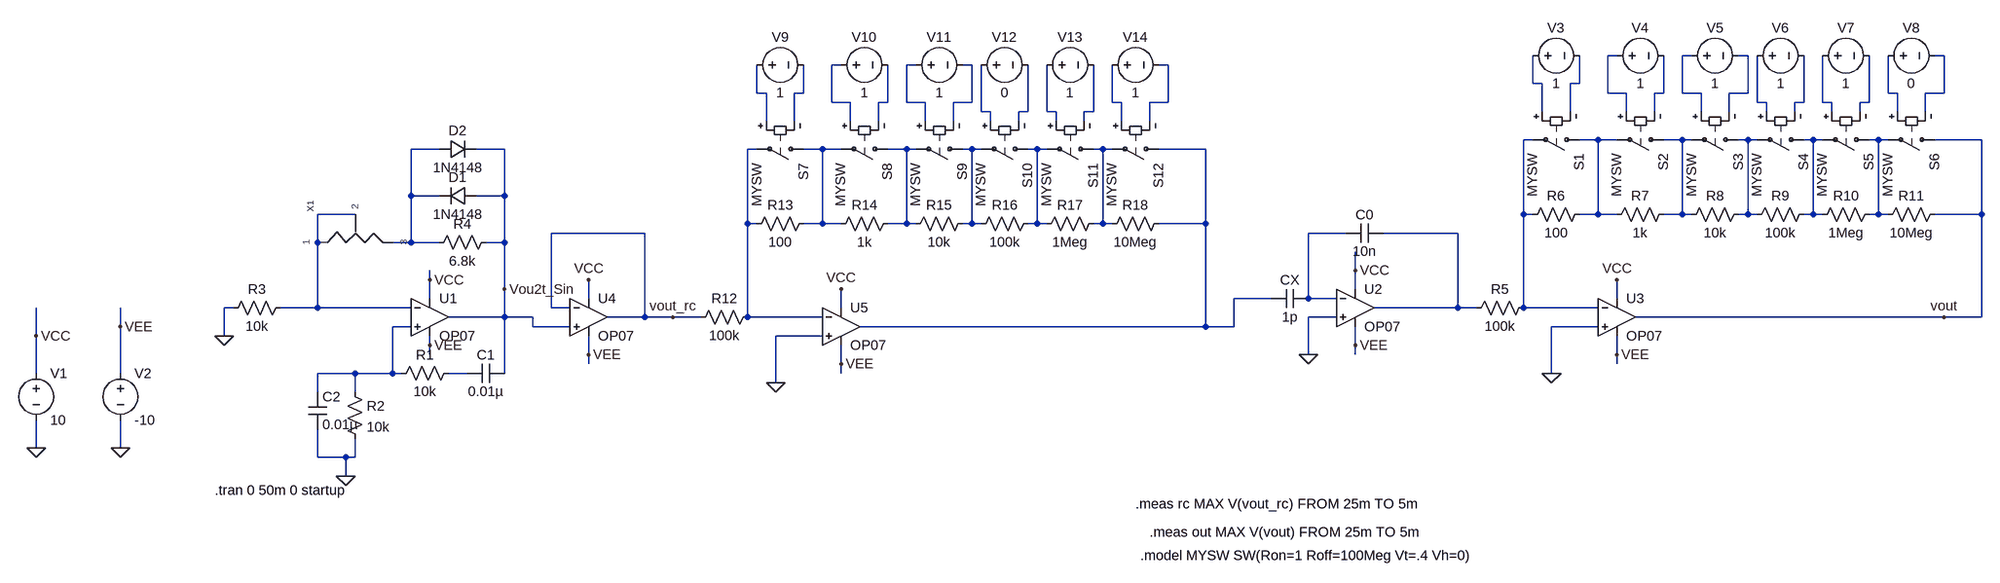
[diagram p0: schematic 4_45.asc]
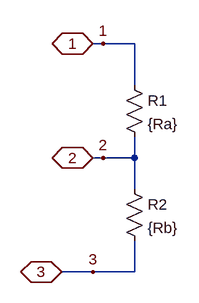
[diagram p1: sub-circuit dian_wei_qi.asc]
4_45.asc, the LTspice schematic file:
Version 4
SHEET 1 3688 680
WIRE 2480 -256 2464 -256
WIRE 2608 -256 2592 -256
WIRE 2704 -256 2688 -256
WIRE 3040 -256 3024 -256
WIRE 1152 -240 1136 -240
WIRE 1280 -240 1264 -240
WIRE 1376 -240 1360 -240
WIRE 1712 -240 1696 -240
WIRE 2336 -208 2336 -256
WIRE 2352 -208 2336 -208
WIRE 2416 -208 2416 -256
WIRE 2416 -208 2400 -208
WIRE 1008 -192 1008 -240
WIRE 1024 -192 1008 -192
WIRE 1088 -192 1088 -240
WIRE 1088 -192 1072 -192
WIRE 2464 -192 2464 -256
WIRE 2496 -192 2464 -192
WIRE 2560 -192 2560 -256
WIRE 2560 -192 2544 -192
WIRE 2592 -192 2592 -256
WIRE 2624 -192 2592 -192
WIRE 2704 -192 2704 -256
WIRE 2704 -192 2672 -192
WIRE 2944 -192 2944 -256
WIRE 2960 -192 2944 -192
WIRE 3040 -192 3040 -256
WIRE 3040 -192 3008 -192
WIRE 1136 -176 1136 -240
WIRE 1168 -176 1136 -176
WIRE 1232 -176 1232 -240
WIRE 1232 -176 1216 -176
WIRE 1264 -176 1264 -240
WIRE 1296 -176 1264 -176
WIRE 1376 -176 1376 -240
WIRE 1376 -176 1344 -176
WIRE 1616 -176 1616 -240
WIRE 1632 -176 1616 -176
WIRE 1712 -176 1712 -240
WIRE 1712 -176 1680 -176
WIRE 2720 -176 2720 -256
WIRE 2736 -176 2720 -176
WIRE 2800 -176 2800 -256
WIRE 2800 -176 2784 -176
WIRE 2832 -176 2832 -256
WIRE 2848 -176 2832 -176
WIRE 2912 -176 2912 -256
WIRE 2912 -176 2896 -176
WIRE 1392 -160 1392 -240
WIRE 1408 -160 1392 -160
WIRE 1472 -160 1472 -240
WIRE 1472 -160 1456 -160
WIRE 1504 -160 1504 -240
WIRE 1520 -160 1504 -160
WIRE 1584 -160 1584 -240
WIRE 1584 -160 1568 -160
WIRE 2352 -160 2352 -208
WIRE 2400 -160 2400 -208
WIRE 2496 -160 2496 -192
WIRE 2544 -160 2544 -192
WIRE 2624 -160 2624 -192
WIRE 2672 -160 2672 -192
WIRE 2736 -160 2736 -176
WIRE 2784 -160 2784 -176
WIRE 2848 -160 2848 -176
WIRE 2896 -160 2896 -176
WIRE 2960 -160 2960 -192
WIRE 3008 -160 3008 -192
WIRE 1024 -144 1024 -192
WIRE 1072 -144 1072 -192
WIRE 1168 -144 1168 -176
WIRE 1216 -144 1216 -176
WIRE 1296 -144 1296 -176
WIRE 1344 -144 1344 -176
WIRE 1408 -144 1408 -160
WIRE 1456 -144 1456 -160
WIRE 1520 -144 1520 -160
WIRE 1568 -144 1568 -160
WIRE 1632 -144 1632 -176
WIRE 1680 -144 1680 -176
WIRE 2336 -112 2320 -112
WIRE 2448 -112 2416 -112
WIRE 2480 -112 2448 -112
WIRE 2592 -112 2560 -112
WIRE 2608 -112 2592 -112
WIRE 2704 -112 2688 -112
WIRE 2720 -112 2704 -112
WIRE 2816 -112 2800 -112
WIRE 2832 -112 2816 -112
WIRE 2928 -112 2912 -112
WIRE 2944 -112 2928 -112
WIRE 3104 -112 3024 -112
WIRE 464 -96 416 -96
WIRE 576 -96 528 -96
WIRE 1008 -96 992 -96
WIRE 1120 -96 1088 -96
WIRE 1152 -96 1120 -96
WIRE 1264 -96 1232 -96
WIRE 1280 -96 1264 -96
WIRE 1376 -96 1360 -96
WIRE 1392 -96 1376 -96
WIRE 1488 -96 1472 -96
WIRE 1504 -96 1488 -96
WIRE 1600 -96 1584 -96
WIRE 1616 -96 1600 -96
WIRE 1776 -96 1696 -96
WIRE 416 -16 416 -96
WIRE 464 -16 416 -16
WIRE 576 -16 576 -96
WIRE 576 -16 528 -16
WIRE 320 16 256 16
WIRE 2320 16 2320 -112
WIRE 2336 16 2320 16
WIRE 2448 16 2448 -112
WIRE 2448 16 2416 16
WIRE 2480 16 2448 16
WIRE 2592 16 2592 -112
WIRE 2592 16 2560 16
WIRE 2608 16 2592 16
WIRE 2704 16 2704 -112
WIRE 2704 16 2688 16
WIRE 2720 16 2704 16
WIRE 2816 16 2816 -112
WIRE 2816 16 2800 16
WIRE 2832 16 2816 16
WIRE 2928 16 2928 -112
WIRE 2928 16 2912 16
WIRE 2944 16 2928 16
WIRE 3104 16 3104 -112
WIRE 3104 16 3024 16
WIRE 992 32 992 -96
WIRE 1008 32 992 32
WIRE 1120 32 1120 -96
WIRE 1120 32 1088 32
WIRE 1152 32 1120 32
WIRE 1264 32 1264 -96
WIRE 1264 32 1232 32
WIRE 1280 32 1264 32
WIRE 1376 32 1376 -96
WIRE 1376 32 1360 32
WIRE 1392 32 1376 32
WIRE 1488 32 1488 -96
WIRE 1488 32 1472 32
WIRE 1504 32 1488 32
WIRE 1600 32 1600 -96
WIRE 1600 32 1584 32
WIRE 1616 32 1600 32
WIRE 1776 32 1776 -96
WIRE 1776 32 1696 32
WIRE 816 48 656 48
WIRE 2016 48 1952 48
WIRE 2208 48 2080 48
WIRE 256 64 256 16
WIRE 416 64 416 -16
WIRE 416 64 384 64
WIRE 464 64 416 64
WIRE 576 64 576 -16
WIRE 576 64 544 64
WIRE 2032 112 2032 80
WIRE 448 128 448 112
WIRE 576 144 576 64
WIRE 2032 144 2032 112
WIRE 448 160 448 128
WIRE 720 160 720 128
WIRE 1888 160 1824 160
WIRE 1952 160 1952 48
WIRE 2000 160 1952 160
WIRE 2480 160 2480 128
WIRE 112 176 96 176
WIRE 256 176 256 64
WIRE 256 176 192 176
WIRE 416 176 256 176
WIRE 656 176 656 48
WIRE 688 176 656 176
WIRE 1152 176 1152 144
WIRE 2208 176 2208 48
WIRE 2208 176 2064 176
WIRE 2240 176 2208 176
WIRE 2320 176 2320 16
WIRE 2448 176 2320 176
WIRE 576 192 576 144
WIRE 576 192 480 192
WIRE 624 192 576 192
WIRE 816 192 816 48
WIRE 816 192 752 192
WIRE 864 192 816 192
WIRE 912 192 864 192
WIRE 992 192 992 32
WIRE 1120 192 992 192
WIRE 2000 192 1952 192
WIRE 3040 192 2512 192
WIRE 3104 192 3104 16
WIRE 3104 192 3040 192
WIRE -160 208 -160 176
WIRE 416 208 384 208
WIRE 624 208 624 192
WIRE 688 208 624 208
WIRE 1776 208 1776 32
WIRE 1776 208 1184 208
WIRE 1824 208 1824 160
WIRE 1824 208 1776 208
WIRE 2448 208 2368 208
WIRE -304 224 -304 176
WIRE 96 224 96 176
WIRE 1120 224 1040 224
WIRE 448 240 448 224
WIRE 2032 240 2032 208
WIRE 448 256 448 240
WIRE 720 256 720 224
WIRE 1952 256 1952 192
WIRE 2032 256 2032 240
WIRE 2480 256 2480 224
WIRE 720 272 720 256
WIRE 1152 272 1152 240
WIRE 2480 272 2480 256
WIRE -304 288 -304 224
WIRE -160 288 -160 208
WIRE 320 288 256 288
WIRE 384 288 384 208
WIRE 384 288 320 288
WIRE 400 288 384 288
WIRE 512 288 480 288
WIRE 576 288 576 192
WIRE 1152 288 1152 272
WIRE 2368 288 2368 208
WIRE 1040 304 1040 224
WIRE 256 320 256 288
WIRE 320 320 320 288
WIRE -304 416 -304 368
WIRE -160 416 -160 368
WIRE 256 432 256 384
WIRE 304 432 256 432
WIRE 320 432 320 400
WIRE 320 432 304 432
WIRE 304 464 304 432
FLAG 96 224 0
FLAG 304 464 0
FLAG 448 128 VCC
FLAG 448 240 VEE
FLAG 576 144 Vou2t_Sin
FLAG -304 416 0
FLAG -160 416 0
FLAG -304 224 VCC
FLAG -160 208 VEE
FLAG 1952 256 0
FLAG 2032 112 VCC
FLAG 2032 240 VEE
FLAG 2480 128 VCC
FLAG 2480 256 VEE
FLAG 2368 288 0
FLAG 720 128 VCC
FLAG 720 256 VEE
FLAG 3040 192 vout
FLAG 1152 144 VCC
FLAG 1152 272 VEE
FLAG 1040 304 0
FLAG 864 192 vout_rc
SYMBOL OpAmps\\OP07 448 128 R0
SYMATTR InstName U1
SYMBOL res 496 272 R90
WINDOW 0 0 56 VBottom 2
WINDOW 3 32 56 VTop 2
SYMATTR InstName R1
SYMATTR Value 10k
SYMBOL cap 576 272 R90
WINDOW 0 0 32 VBottom 2
WINDOW 3 32 32 VTop 2
SYMATTR InstName C1
SYMATTR Value 0.01µ
SYMBOL res 304 304 R0
SYMATTR InstName R2
SYMATTR Value 10k
SYMBOL cap 240 320 R0
SYMATTR InstName C2
SYMATTR Value 0.01µ
SYMBOL res 208 160 R90
WINDOW 0 0 56 VBottom 2
WINDOW 3 32 56 VTop 2
SYMATTR InstName R3
SYMATTR Value 10k
SYMBOL dian_wei_qi 320 80 R270
SYMATTR InstName X1
SYMATTR SpiceLine Ra=1,Rb=14k
SYMBOL res 560 48 R90
WINDOW 0 0 56 VBottom 2
WINDOW 3 32 56 VTop 2
SYMATTR InstName R4
SYMATTR Value 6.8k
SYMBOL diode 528 -32 R90
WINDOW 0 0 32 VBottom 2
WINDOW 3 32 32 VTop 2
SYMATTR InstName D1
SYMATTR Value 1N4148
SYMBOL diode 464 -80 R270
WINDOW 0 32 32 VTop 2
WINDOW 3 0 32 VBottom 2
SYMATTR InstName D2
SYMATTR Value 1N4148
SYMBOL voltage -304 272 R0
WINDOW 123 0 0 Left 0
WINDOW 39 0 0 Left 0
SYMATTR InstName V1
SYMATTR Value 10
SYMBOL voltage -160 272 R0
WINDOW 123 0 0 Left 0
WINDOW 39 0 0 Left 0
SYMATTR InstName V2
SYMATTR Value -10
SYMBOL OpAmps\\OP07 2032 112 R0
SYMATTR InstName U2
SYMBOL cap 1952 144 R90
WINDOW 0 0 32 VBottom 2
WINDOW 3 32 32 VTop 2
SYMATTR InstName CX
SYMATTR Value 1p
SYMBOL cap 2080 32 R90
WINDOW 0 0 32 VBottom 2
WINDOW 3 32 32 VTop 2
SYMATTR InstName C0
SYMATTR Value 10n
SYMBOL OpAmps\\OP07 2480 128 R0
SYMATTR InstName U3
SYMBOL res 2336 160 R90
WINDOW 0 0 56 VBottom 2
WINDOW 3 32 56 VTop 2
SYMATTR InstName R5
SYMATTR Value 100k
SYMBOL res 2432 0 R90
WINDOW 0 0 56 VBottom 2
WINDOW 3 32 56 VTop 2
SYMATTR InstName R6
SYMATTR Value 100
SYMBOL res 2576 0 R90
WINDOW 0 0 56 VBottom 2
WINDOW 3 32 56 VTop 2
SYMATTR InstName R7
SYMATTR Value 1k
SYMBOL res 2704 0 R90
WINDOW 0 0 56 VBottom 2
WINDOW 3 32 56 VTop 2
SYMATTR InstName R8
SYMATTR Value 10k
SYMBOL res 2816 0 R90
WINDOW 0 0 56 VBottom 2
WINDOW 3 32 56 VTop 2
SYMATTR InstName R9
SYMATTR Value 100k
SYMBOL res 2928 0 R90
WINDOW 0 0 56 VBottom 2
WINDOW 3 32 56 VTop 2
SYMATTR InstName R10
SYMATTR Value 1Meg
SYMBOL res 3040 0 R90
WINDOW 0 0 56 VBottom 2
WINDOW 3 32 56 VTop 2
SYMATTR InstName R11
SYMATTR Value 10Meg
SYMBOL sw 2432 -112 R90
SYMATTR InstName S1
SYMATTR Value MYSW
SYMBOL sw 2576 -112 R90
SYMATTR InstName S2
SYMATTR Value MYSW
SYMBOL sw 2704 -112 R90
SYMATTR InstName S3
SYMATTR Value MYSW
SYMBOL sw 2816 -112 R90
SYMATTR InstName S4
SYMATTR Value MYSW
SYMBOL sw 2928 -112 R90
SYMATTR InstName S5
SYMATTR Value MYSW
SYMBOL sw 3040 -112 R90
SYMATTR InstName S6
SYMATTR Value MYSW
SYMBOL voltage 2320 -256 R270
WINDOW 0 32 56 VTop 2
WINDOW 3 -32 56 VBottom 2
WINDOW 123 0 0 Left 0
WINDOW 39 0 0 Left 0
SYMATTR InstName V3
SYMATTR Value 1
SYMBOL voltage 2464 -256 R270
WINDOW 0 32 56 VTop 2
WINDOW 3 -32 56 VBottom 2
WINDOW 123 0 0 Left 0
WINDOW 39 0 0 Left 0
SYMATTR InstName V4
SYMATTR Value 1
SYMBOL voltage 2592 -256 R270
WINDOW 0 32 56 VTop 2
WINDOW 3 -32 56 VBottom 2
WINDOW 123 0 0 Left 0
WINDOW 39 0 0 Left 0
SYMATTR InstName V5
SYMATTR Value 1
SYMBOL voltage 2704 -256 R270
WINDOW 0 32 56 VTop 2
WINDOW 3 -32 56 VBottom 2
WINDOW 123 0 0 Left 0
WINDOW 39 0 0 Left 0
SYMATTR InstName V6
SYMATTR Value 1
SYMBOL voltage 2816 -256 R270
WINDOW 0 32 56 VTop 2
WINDOW 3 -32 56 VBottom 2
WINDOW 123 0 0 Left 0
WINDOW 39 0 0 Left 0
SYMATTR InstName V7
SYMATTR Value 1
SYMBOL voltage 2928 -256 R270
WINDOW 0 32 56 VTop 2
WINDOW 3 -32 56 VBottom 2
WINDOW 123 0 0 Left 0
WINDOW 39 0 0 Left 0
SYMATTR InstName V8
SYMATTR Value 0
SYMBOL OpAmps\\OP07 720 128 R0
SYMATTR InstName U4
SYMBOL OpAmps\\OP07 1152 144 R0
SYMATTR InstName U5
SYMBOL res 1008 176 R90
WINDOW 0 0 56 VBottom 2
WINDOW 3 32 56 VTop 2
SYMATTR InstName R12
SYMATTR Value 100k
SYMBOL res 1104 16 R90
WINDOW 0 0 56 VBottom 2
WINDOW 3 32 56 VTop 2
SYMATTR InstName R13
SYMATTR Value 100
SYMBOL res 1248 16 R90
WINDOW 0 0 56 VBottom 2
WINDOW 3 32 56 VTop 2
SYMATTR InstName R14
SYMATTR Value 1k
SYMBOL res 1376 16 R90
WINDOW 0 0 56 VBottom 2
WINDOW 3 32 56 VTop 2
SYMATTR InstName R15
SYMATTR Value 10k
SYMBOL res 1488 16 R90
WINDOW 0 0 56 VBottom 2
WINDOW 3 32 56 VTop 2
SYMATTR InstName R16
SYMATTR Value 100k
SYMBOL res 1600 16 R90
WINDOW 0 0 56 VBottom 2
WINDOW 3 32 56 VTop 2
SYMATTR InstName R17
SYMATTR Value 1Meg
SYMBOL res 1712 16 R90
WINDOW 0 0 56 VBottom 2
WINDOW 3 32 56 VTop 2
SYMATTR InstName R18
SYMATTR Value 10Meg
SYMBOL sw 1104 -96 R90
SYMATTR InstName S7
SYMATTR Value MYSW
SYMBOL sw 1248 -96 R90
SYMATTR InstName S8
SYMATTR Value MYSW
SYMBOL sw 1376 -96 R90
SYMATTR InstName S9
SYMATTR Value MYSW
SYMBOL sw 1488 -96 R90
SYMATTR InstName S10
SYMATTR Value MYSW
SYMBOL sw 1600 -96 R90
SYMATTR InstName S11
SYMATTR Value MYSW
SYMBOL sw 1712 -96 R90
SYMATTR InstName S12
SYMATTR Value MYSW
SYMBOL voltage 992 -240 R270
WINDOW 0 32 56 VTop 2
WINDOW 3 -32 56 VBottom 2
WINDOW 123 0 0 Left 0
WINDOW 39 0 0 Left 0
SYMATTR InstName V9
SYMATTR Value 1
SYMBOL voltage 1136 -240 R270
WINDOW 0 32 56 VTop 2
WINDOW 3 -32 56 VBottom 2
WINDOW 123 0 0 Left 0
WINDOW 39 0 0 Left 0
SYMATTR InstName V10
SYMATTR Value 1
SYMBOL voltage 1264 -240 R270
WINDOW 0 32 56 VTop 2
WINDOW 3 -32 56 VBottom 2
WINDOW 123 0 0 Left 0
WINDOW 39 0 0 Left 0
SYMATTR InstName V11
SYMATTR Value 1
SYMBOL voltage 1376 -240 R270
WINDOW 0 32 56 VTop 2
WINDOW 3 -32 56 VBottom 2
WINDOW 123 0 0 Left 0
WINDOW 39 0 0 Left 0
SYMATTR InstName V12
SYMATTR Value 0
SYMBOL voltage 1488 -240 R270
WINDOW 0 32 56 VTop 2
WINDOW 3 -32 56 VBottom 2
WINDOW 123 0 0 Left 0
WINDOW 39 0 0 Left 0
SYMATTR InstName V13
SYMATTR Value 1
SYMBOL voltage 1600 -240 R270
WINDOW 0 32 56 VTop 2
WINDOW 3 -32 56 VBottom 2
WINDOW 123 0 0 Left 0
WINDOW 39 0 0 Left 0
SYMATTR InstName V14
SYMATTR Value 1
TEXT 80 488 Left 2 !.tran 0 50m 0 startup
TEXT 1664 600 Left 2 !.model MYSW SW(Ron=1 Roff=100Meg Vt=.4 Vh=0)
TEXT 1656 512 Left 2 !.meas rc MAX V(vout_rc) FROM 25m TO 5m
TEXT 1680 560 Left 2 !.meas out MAX V(vout) FROM 25m TO 5m

dian_wei_qi.asc, the sub-circuit schematic file:
Version 4
SHEET 1 880 680
WIRE 144 -32 128 -32
WIRE 192 -32 144 -32
WIRE 192 32 192 -32
WIRE 144 144 128 144
WIRE 192 144 192 112
WIRE 192 144 144 144
WIRE 192 192 192 144
WIRE 128 320 80 320
WIRE 192 320 192 272
WIRE 192 320 128 320
FLAG 144 -32 1
FLAG 144 144 2
FLAG 128 320 3
FLAG 128 -32 1
IOPIN 128 -32 BiDir
FLAG 128 144 2
IOPIN 128 144 BiDir
FLAG 80 320 3
IOPIN 80 320 BiDir
SYMBOL res 176 16 R0
SYMATTR InstName R1
SYMATTR Value {Ra}
SYMBOL res 176 176 R0
SYMATTR InstName R2
SYMATTR Value {Rb}

The netlist it stands for:
* 4_45.asc
XU1 N042 N039 VCC VEE Vou2t_Sin LT1001  ; OP07, pins In+ In- V+ V- OUT
R1 N043 N042 10k
C1 Vou2t_Sin N043 0.01µ
R2 N042 0 10k
C2 N042 0 0.01µ
R3 N039 0 10k
XX1 N039 N039 N031 dian_wei_qi params: Ra=1,Rb=14k
R4 Vou2t_Sin N031 6.8k
D1 Vou2t_Sin N031 1N4148
D2 N031 Vou2t_Sin 1N4148
V1 VCC 0 10
V2 VEE 0 -10
XU2 0 N040 VCC VEE N041 LT1001  ; OP07, pins In+ In- V+ V- OUT
CX N040 N038 1p
C0 N041 N040 10n
XU3 0 N025 VCC VEE vout LT1001  ; OP07, pins In+ In- V+ V- OUT
R5 N025 N041 100k
R6 N026 N025 100
R7 N027 N026 1k
R8 N028 N027 10k
R9 N029 N028 100k
R10 N030 N029 1Meg
R11 vout N030 10Meg
S1 N026 N025 N009 N010 MYSW
S2 N027 N026 N001 N013 MYSW
S3 N028 N027 N002 N003 MYSW
S4 N029 N028 N017 N018 MYSW
S5 N030 N029 N019 N020 MYSW
S6 vout N030 N014 N004 MYSW
V3 N009 N010 1
V4 N001 N013 1
V5 N002 N003 1
V6 N017 N018 1
V7 N019 N020 1
V8 N014 N004 0
XU4 Vou2t_Sin vout_rc VCC VEE vout_rc LT1001  ; OP07, pins In+ In- V+ V- OUT
XU5 0 N032 VCC VEE N038 LT1001  ; OP07, pins In+ In- V+ V- OUT
R12 N032 vout_rc 100k
R13 N033 N032 100
R14 N034 N033 1k
R15 N035 N034 10k
R16 N036 N035 100k
R17 N037 N036 1Meg
R18 N038 N037 10Meg
S7 N033 N032 N011 N012 MYSW
S8 N034 N033 N005 N015 MYSW
S9 N035 N034 N006 N007 MYSW
S10 N036 N035 N021 N022 MYSW
S11 N037 N036 N023 N024 MYSW
S12 N038 N037 N016 N008 MYSW
V9 N011 N012 1
V10 N005 N015 1
V11 N006 N007 1
V12 N021 N022 0
V13 N023 N024 1
V14 N016 N008 1

* block symbol definitions
.subckt dian_wei_qi 1 2 3
R1 1 2 {Ra}
R2 2 3 {Rb}
.ends dian_wei_qi

.model D D
.lib standard.dio
.tran 0 50m 0 startup
.model MYSW SW(Ron=1 Roff=100Meg Vt=.4 Vh=0)
.meas rc MAX V(vout_rc) FROM 25m TO 5m
.meas out MAX V(vout) FROM 25m TO 5m
.lib LTC.lib
.backanno
.end

* Results of the author's LTspice run, read from the files saved beside the schematic
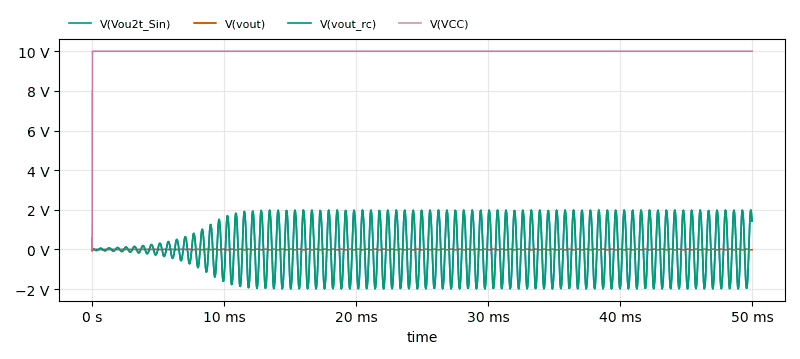
[diagram p2: Transient Analysis of 4_45.asc, plotted from the saved traces]
* Transient Analysis, 1 run:
*   V(Vou2t_Sin): min -1.987 V, max 1.987 V, average 3.016 mV, rms 1.28 V, last 1.43 V
*   V(vout): min -79.59 mV, max 437.8 mV, average -425.5 µV, rms 11.88 mV, last -15.18 mV
*   V(vout_rc): min -1.987 V, max 1.987 V, average 3.02 mV, rms 1.28 V, last 1.433 V
*   V(VCC): min 0 V, max 10 V, average 9.998 V, rms 9.999 V, last 10 V
* From the log:
*   rc: MAX(v(vout_rc))=1.98625 FROM 0.025 TO 0.005
*   out: MAX(v(vout))=0.01727 FROM 0.025 TO 0.005